# Altium schematic sheet Bomba_Agua.SchDoc
size Tabloid; SheetNumber: 2; SheetTotal: 2
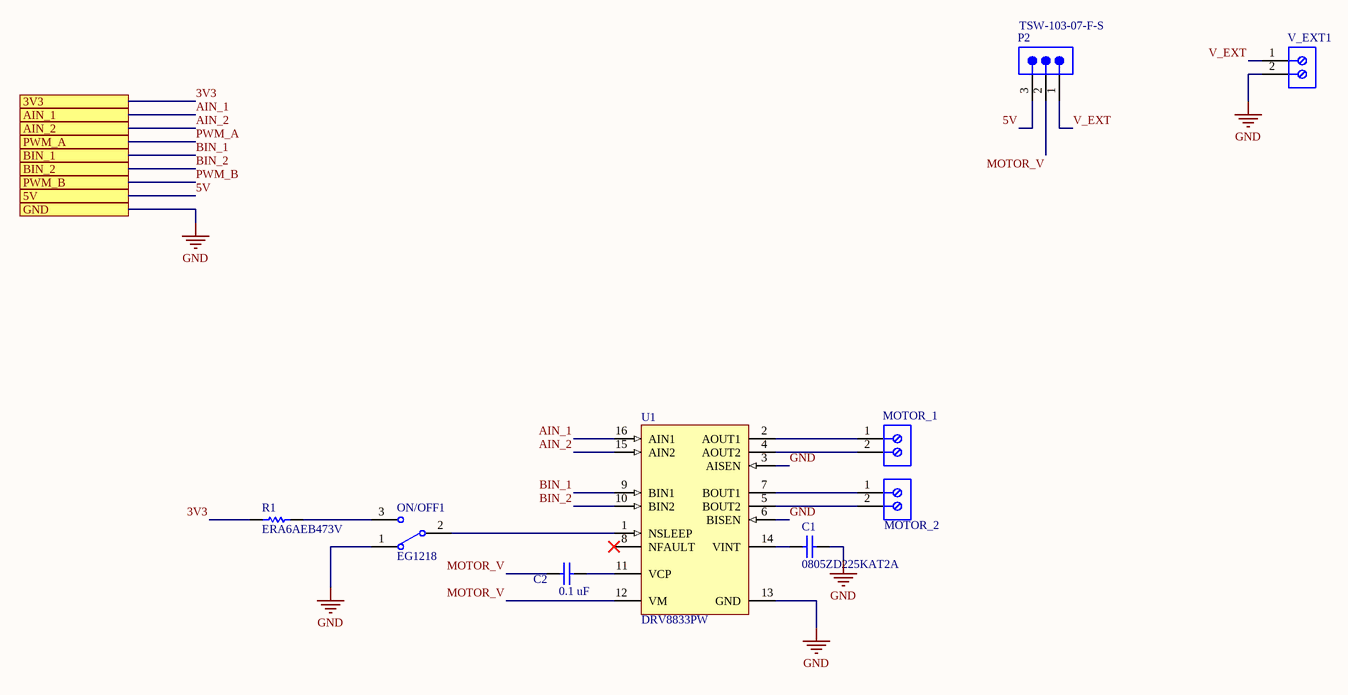
[diagram p0: Bomba_Agua.SchDoc]

## Parts
C1  0805ZD225KAT2A  [CAPC2013X140X50ML20T25]
C2  0.1 uF  [CAPC2013X94X50ML20T25]
MOTOR_1  691214110002  [691214110002]  (value not drawn)
MOTOR_2  691214110002  [691214110002]  (value not drawn)
ON/OFF1  EG1218  [ESWI-EG1218_V]
P2  TSW-103-07-F-S  [SMTC-TSW-103-07-X-S]
R1  ERA6AEB473V  [RESC2013X60X40ML20T25]
U1  DRV8833PW  [PW0016A_M]
V_EXT1  691214110002  [691214110002]  (value not drawn)

## Ports
3V3, 5V, AIN_1, AIN_2, BIN_1, BIN_2, GND, PWM_A, PWM_B

## Nets
GND: C1.2 ON/OFF1.1 U1.3(AISEN) U1.6(BISEN) U1.13(GND) V_EXT1.2 ; port GND
3V3: R1.2 ; port 3V3
5V: P2.3 ; port 5V
AIN_1: U1.16(AIN1) ; port AIN_1
AIN_2: U1.15(AIN2) ; port AIN_2
BIN_1: U1.9(BIN1) ; port BIN_1
BIN_2: U1.10(BIN2) ; port BIN_2
MOTOR_V: C2.2 P2.2 U1.12(VM)
PWM_A: port PWM_A
PWM_B: port PWM_B
V_EXT: P2.1 V_EXT1.1
NetC1_1: C1.1 U1.14(VINT)
NetC2_1: C2.1 U1.11(VCP)
NetMOTOR_1_1: MOTOR_1.1 U1.2(AOUT1)
NetMOTOR_1_2: MOTOR_1.2 U1.4(AOUT2)
NetMOTOR_2_1: MOTOR_2.1 U1.7(BOUT1)
NetMOTOR_2_2: MOTOR_2.2 U1.5(BOUT2)
NetON/OFF1_2: ON/OFF1.2(COM) U1.1(NSLEEP)
NetON/OFF1_3: ON/OFF1.3 R1.1

Not connected (* = marked no-connect by the designer): U1 8(NFAULT)*

## Library data of the parts
C1 = CMP-2000-05810-1: Chip Capacitor, 2.2 uF, +/- 10%, 10 V, -55 to 85 degC, 0805 (2012 Metric), RoHS, Tape and Reel; Manufacturer: AVX; Dielectric: X5R; Rated Voltage: 10V; Capacitance: 2.2µF; Tolerance (%): ±10%; Datasheet Version: 05/2016; Manufacturer URL: http://www.avx.com/; Package Description: 2-Pin Surface Mount Device, Body 2.01 x 1.25 mm; Mounting Technology: SurfaceMount; Case Size/Dimension: 0805; Package Reference: 0805; Datasheet URL: http://datasheets.avx.com/cx5r.pdf
C2 = CMP-2000-05016-1: Chip Capacitor, Ceramic, 0.1 uF, 10%, 50 V, 0805, RoHS, Tape and Reel; Manufacturer: AVX; Rated Voltage: 50V; Capacitance: 100nF; Dielectric: X7R; Case Size/Dimension: 0805; Tolerance (%): ±10%; Datasheet URL: http://www.farnell.com/datasheets/319609.pdf; Datasheet Version: Sep-07; Manufacturer URL: http://www.avx.com/
MOTOR_1 MOTOR_2 V_EXT1 = CMP-1502-02464-1: Serie 2141 - 3.50 mm Horizontal Entry Modular with Rising Cage Clamp WR-TBL, 2 pin; Manufacturer: Wurth Elektronik; Pin Number: 2; Pitch: 3.50mm; Datasheet URL: http://katalog.we-online.de/em/datasheet/6912141100xx.pdf; Packaging: Box; Mounting Technology: THT; Package Reference: 691214110002; Manufacturer URL: http://www.we-online.de; Part Number: 691214110002; Publisher: WurthElektronik; Operating Temperature: -40to105degC
ON/OFF1 = CMP-1696-00002-1: Slide Switch, 500 V, -20 to 70 degC, 3-Pin THD, RoHS; Case\Package: SOT-23-5; Output Current: 150 mA; Nominal Output Voltage: 3.3 V; Max Power Dissipation: 250 mW; Min Input Voltage: 4.3 V; Outputs: 1; Max Input Voltage: 8 V; Dropout Voltage: 300 mV; PackageDescription: 3-Pin Through Hole Device, Body 11.6 x 4 mm, Pitch 2.5 mm; ComponentLink1URL: http://www.e-switch.ch/en/; RoHSCompliant: true; Length: 3 mm; ComponentLink1Description: Manufacturer URL; Power Rating: 250 mW; Mount: Surface Mount; Max Operating Temperature: 85 degC; REACH SVHC: No SVHC; Radiation Hardening: No; Height: 1.3 mm; Pins: 5; Max Ouput Current: 150 mA; Output Voltage: 3.3 V; Width: 1.8 mm; Package Quantity: 3000; ComponentLink2URL: https://www.e-switch.com/system/asset/product_line/data_sheet/119/EG.pdf; Min Operating Temperature: -40 degC; ComponentLink2Description: Datasheet; DatasheetVersion: Oct-15; PackageReference: EG1218; Packaging: Tape and Reel
P2 = CMP-1024-00331-1: 0.025" SQ Post Header, Through-hole, Vertical, -55 to 125 degC, 2.54 mm Pitch, 3-Pin, Male, RoHS; Manufacturer: Samtec; Pitch: 2.54 mm; DatasheetVersion: F-214; ComponentLink1Description: Manufacturer URL; ComponentLink3URL: http://www.samtec.com/documents/webfiles/cpdf/TSW-XXX-XX-XXX-X-XX-XXX-MKT.pdf; Mounting Technology: Through-hole; PackageDescription: .025[0.64] SQ. Post Terminal Strip Assembly; Temperature Range: -55 to 125 degC; ComponentLink3Description: Package Specification; Orientation: Vertical; PartNumber: TSW-103-07-F-S; RoHS: True; PackageVersion: DM, 8/1988; ComponentLink2Description: Datasheet; ComponentLink1URL: http://www.samtec.com; ComponentLink2URL: http://www.samtec.com/documents/webfiles/pdf/TSW_TH.PDF; PackageReference: TSW-103-07-X-S
R1 = CMP-2001-00645-1: Manufacturer: Panasonic; Part Number: ERA6AEB473V
U1 = CMP-1529-00002-2: 2 A Low Voltage Dual Brushed DC or Single Bipolar Stepper Motor Driver (PWM Ctrl), 2.7 to 10.8 V, -40 to 85 degC, 16-Pin SOP (PW), Green (RoHS & no Sb/Br), Tube; Manufacturer: Texas Instruments; Peak Output Current: 2 A; RMS Output Current: 1.5 A; Vs: 2.7 V Min.; rDS (ON) (LS + HS): 360 mOhms; PackageVersion: 4040064-4/G; Temperature Range: -40 to 85 degC; ComponentLink2Description: Datasheet; Mounting Technology: Surface Mount; DatasheetVersion: SLVSAR1D; Control I/F: PWM; Eco-Plan: Green (RoHS & no Sb/Br); ComponentLink3URL: http://www.ti.com/lit/ml/mpds361/mpds361.pdf; ComponentLink1Description: Manufacturer URL; PartNumber: DRV8833PW; Package Reference: PW0016A; Packing: Tube; PackageDescription: 16-Pin Plastic Small Outline, Body 4.4 x 5 mm, Pitch 0.65 mm; ComponentLink3Description: Package Specification; ComponentLink1URL: www.ti.com; ComponentLink2URL: http://www.ti.com/lit/ds/symlink/drv8833.pdf